# Altium schematic sheet AckDetect.SchDoc
size A4
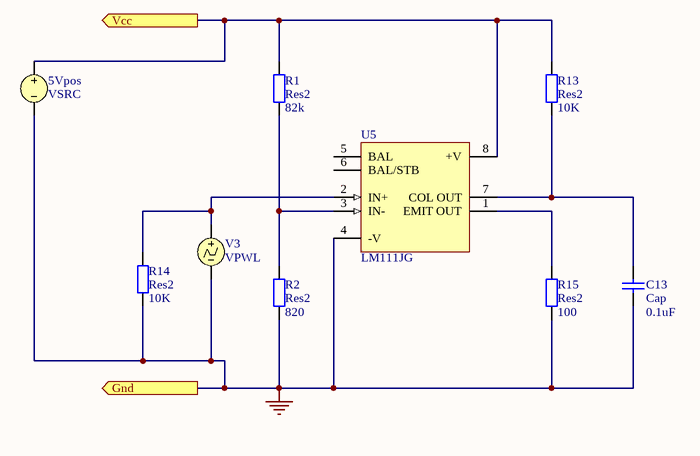
[diagram p0: AckDetect.SchDoc]

## Parts
5Vpos  VSRC
C13  Cap  value 0.1uF  [RAD-0.3]
R1  Res2  value 82k  [AXIAL-0.4]
R2  Res2  value 820  [AXIAL-0.4]
R13  Res2  value 10K  [AXIAL-0.4]
R14  Res2  value 10K  [AXIAL-0.4]
R15  Res2  value 100  [AXIAL-0.4]
U5  LM111JG  [JG008]
V3  VPWL

## Ports
Gnd, Vcc

## Nets
GND: 5Vpos.2 C13.1 R2.1 R14.1 R15.1 U5.4(-V) V3.2 ; port Gnd
Vcc: 5Vpos.1 R1.2 R13.2 U5.8(+V) ; port Vcc
NetC13_2: C13.2 R13.1 U5.7(COL_OUT)
NetR1_1: R1.1 R2.2 U5.3(IN-)
NetR14_2: R14.2 U5.2(IN+) V3.1
NetR15_2: R15.2 U5.1(EMIT_OUT)

Not connected (* = marked no-connect by the designer): U5 5(BAL) 6(BAL/STB)

## Library data of the parts
5Vpos = VSRC: Voltage Source; Manufacturer: Generic Components; Class: Simulation; Note: PCB Footprint - Not required; Published: 8/06/2000; Publisher: Altium Hobart Technology Centre; Sub-Class: Voltage Source
C13 = Cap: Capacitor; Published: 8-Jun-2000; Revision: July-2002: Re-released for DXP Platform.; Publisher: Altium Limited
R1 R2 R13-R15 = Res2: Resistor; Published: 8-Jun-2000; Revision: July-2002: Re-released for DXP Platform.; Publisher: Altium Limited
U5 = LM111JG: Differential Comparator with Strobe; Package Information: Latest Revision: Jan-1995; Published: 16-Jan-2001; Revision: 17-Jul-2002: Re-released for DXP Platform.; Datasheet: Latest Revision: Feb-1992; Package Reference: JG008; Publisher: Altium Limited
V3 = VPWL: Piecewise Linear Voltage Source; Manufacturer: Generic Components; Class: Simulation; Note: PCB Footprint - Not required; Published: 8/06/2000; Publisher: Altium Hobart Technology Centre; Sub-Class: Voltage Source